# EAGLE design Doorbell (EAGLE 8.1.0)
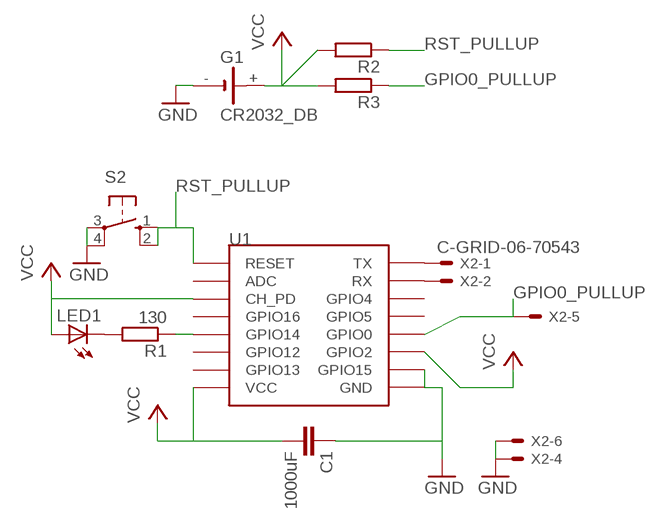
[diagram p0: schematic, sheet 1]

## Parts
C1  1000uF  C5/3.5  [C5B3.5]
G1  CR2032_DB  [CR2032_DOORBELL]
LED1  LED3MM  [LED3MM]
R1  130  R-EU_0204/5  [0204/5]
R2  R-EU_0204/5  [0204/5]
R3  R-EU_0204/5  [0204/5]
S2  10-XX  [B3F-10XX]
U1  ESP12  [ESP12]
X2  C-GRID-06-70543  [70543-06]

## Nets
GND: C1.1 G1.- S2.3(P) S2.4(P1) U1.GND U1.GPIO15 X2.4 X2.6
GPIO0_PULLUP: R3.1 U1.GPIO0 X2.5
N$1: U1.TX X2.1
N$2: U1.RX X2.2
N$5: R1.1 U1.GPIO14
N$6: LED1.K(C) R1.2
RST_PULLUP: R2.1 S2.1(S) S2.2(S1) U1.RESET
VCC: C1.2 G1.+ LED1.A R2.2 R3.2 U1.CH_PD U1.GPIO2 U1.VCC
Unconnected: U1.ADC U1.GPIO4 U1.GPIO5 U1.GPIO12 U1.GPIO13 U1.GPIO16 X2.3

## Library data of the parts
C1 = capacitor-wima:C: CAPACITOR naming: grid - package width
G1 = battery:CR2032_DB
LED1 = led:LED: LED OSRAM: - CHIPLED LG R971, LG N971, LY N971, LG Q971, LY Q971, LO R971, LY R971 LH N974, LH R974 LS Q976, LO Q976, LY Q976 LO Q996 - Hyper CHIPLED LW Q18S LB Q993, LB Q99A, LB R99A - SideLED LS A670, LO A670, LY A670, LG A670, LP A670 LB A673, LV A673, LT A673, LW A673 LH A674 LY A675 LS A676, LA A676, LO A676, LY A676, LW A676 LS A679, LY A679, LG A679 - Hyper Micro SIDELED® LS Y876, LA Y876, LO Y876, LY Y876 LT Y87S - SmartLED LW L88C, LW L88S LB L89C, LB L89S, LG L890 LS L89K, LO L89K, LY L89K LS L896, LA L896, LO L896, LY L896 - TOPLED LS T670, LO T670, LY T670, LG T670, LP T670 LSG T670, LSP T670, LSY T670, LOP T670, LYG T670 LG T671, LOG T671, LSG T671 LB T673, LV T673, LT T673, LW T673 LH T674 LS T676, LA T676, LO T676, LY T676, LB T676, LH T676, LSB T676, LW T676 LB T67C, LV T67C, LT T67C, LS T67K, LO T67K, LY T67K, LW E67C LS E67B, LA E67B, LO E67B, LY E67B, LB E67C, LV E67C, LT E67C LW T67C LS T679, LY T679, LG T679 LS T770, LO T770, LY T770, LG T770, LP T770 LB T773, LV T773, LT T773, LW T773 LH T774 LS E675, LA E675, LY E675, LS T675 LS T776, LA T776, LO T776, LY T776, LB T776 LHGB T686 LT T68C, LB T68C - Hyper Mini TOPLED® LB M676 - Mini TOPLED Santana® LG M470 LS M47K, LO M47K, LY M47K Source: http://www.osram.convergy.de LUXEON: - LUMILED® LXK2-PW12-R00, LXK2-PW12-S00, LXK2-PW14-U00, LXK2-PW14-V00 LXK2-PM12-R00, LXK2-PM12-S00, LXK2-PM14-U00 LXK2-PE12-Q00, LXK2-PE12-R00, LXK2-PE12-S00, LXK2-PE14-T00, LXK2-PE14-U00 LXK2-PB12-K00, LXK2-PB12-L00, LXK2-PB12-M00, LXK2-PB14-N00, LXK2-PB14-P00, LXK2-PB14-Q00 LXK2-PR12-L00, LXK2-PR12-M00, LXK2-PR14-Q00, LXK2-PR14-R00 LXK2-PD12-Q00, LXK2-PD12-R00, LXK2-PD12-S00 LXK2-PH12-R00, LXK2-PH12-S00 LXK2-PL12-P00, LXK2-PL12-Q00, LXK2-PL12-R00 Source: www.luxeon.com KINGBRIGHT: KA-3528ASYC Source: www.kingbright.com
R1-R3 = resistor:R-EU_: RESISTOR, European symbol
S2 = switch-omron:10-XX: OMRON SWITCH; MPN: B3F-1000; OC_FARNELL: 176432; OC_NEWARK: 36M3542
U1 = esp8266modules:ESP12: ESP8266 Wifi module 12
X2 = con-molex:C-GRID-06: CONNECTOR wire to board 2.54 mm (0.100") pitch header; OC_FARNELL: unknown; OC_NEWARK: unknown

## Board
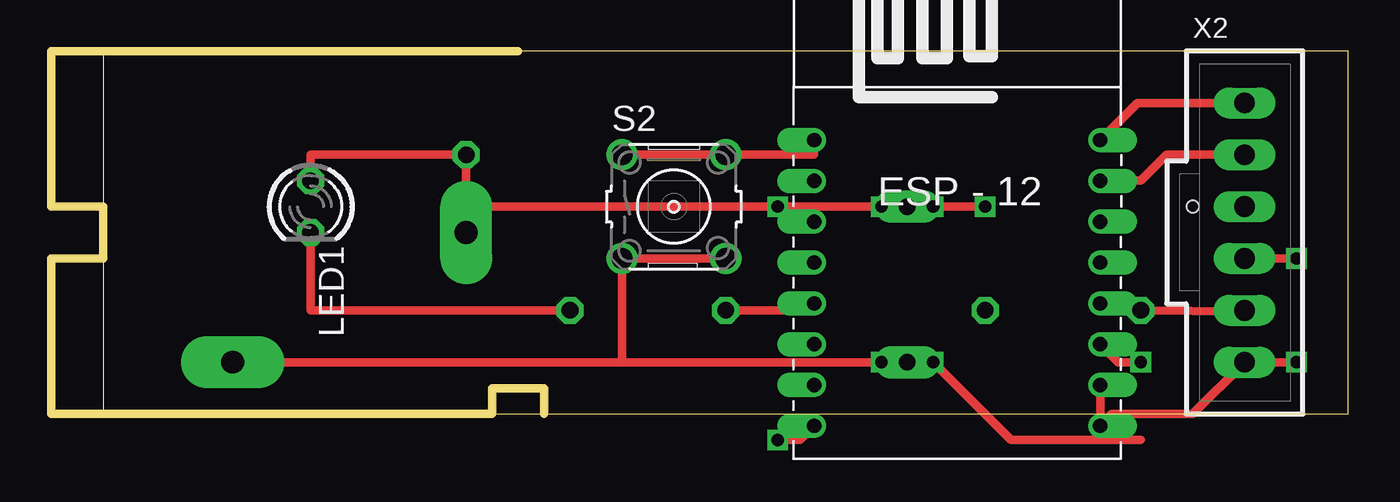
[diagram p1: board, top side]
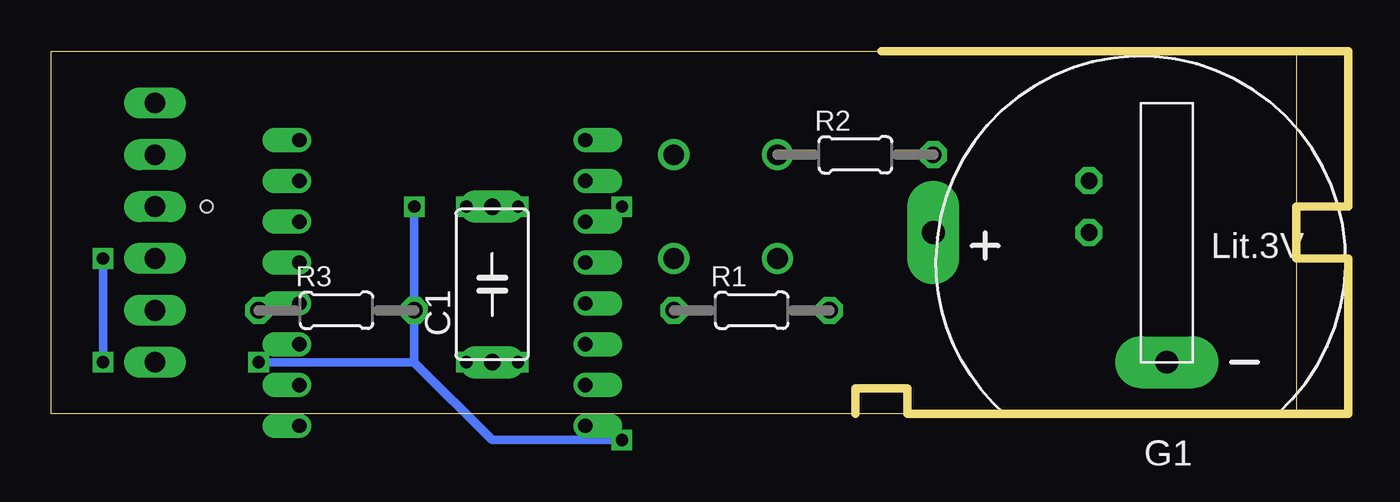
[diagram p2: board, bottom side, seen from below]

Size 63.5 x 17.78 mm. Coordinates in mm from the lower left corner, seen from the top.
Outline: 21.59,0 24.13,0
Outline: 24.13,0 63.5,0 63.5,17.78 22.86,17.78 2.54,17.78
Outline: 2.54,17.78 2.54,10.16
Outline: 2.54,7.62 2.54,0
Outline: 2.54,10.16 0,10.16 0,17.78 2.54,17.78
Outline: 2.54,7.62 0,7.62 0,0 2.54,0
Outline: 21.59,0 21.59,1.27 24.13,1.27 24.13,0
Outline: 21.59,0 2.54,0
Outline: 2.54,10.16 2.54,7.62
Copper layers (1*16): Top 0.035mm / dielectric 1.5mm / Bottom 0.035mm
Design rules "default": minimum track width 10mil, minimum drill 24mil, track to track 8mil, track to pad 8mil, pad to pad 8mil, via to via 8mil, smd to smd 8mil, copper to edge 40mil, drill to drill 8mil, minimum pad ring 10mil, minimum via ring 8mil, stop-mask expansion 4mil, vias tented up to drill 0mil, thermal gap 10mil
Holes 0.6 mm at 55.88,10.16

### Footprints (pad centres in the part's own frame; a part is rotated, then mirrored left to right if it is on the bottom)
C5B3.5 = drill 0.813 pad 1.6 long: 1 -3.81,0; 2 3.81,0
CR2032_DOORBELL = drill 1.118 pad 2.54 long: + 10.16,-1.27; - -1.27,5.08
LED3MM = drill 0.813 octagon: A -1.27,0; K 1.27,0
0204/5 = drill 0.813 octagon: 1 -3.81,0; 2 3.81,0
B3F-10XX = drill 1.016: 1 -2.54,2.54; 2 2.54,2.54; 3 -2.54,-2.54; 4 2.54,-2.54
ESP12 = drill 0.7 offset: ADC -7.1,3.8; CH_PD -7.1,1.8; GND 6.9,-8.2; GPIO0 6.9,-2.2; GPIO2 6.9,-4.2; GPIO4 6.9,1.8; GPIO5 6.9,-0.2; GPIO12 -7.1,-4.2; GPIO13 -7.1,-6.2; GPIO14 -7.1,-2.2; GPIO15 6.9,-6.2; GPIO16 -7.1,-0.2; RESET -7.1,5.8; RX 6.9,3.8; TX 6.9,5.8; VCC -7.1,-8.2
70543-06 = drill 1.016 long: 1 -6.35,0; 2 -3.81,0; 3 -1.27,0; 4 1.27,0; 5 3.81,0; 6 6.35,0

### Placement (x,y rotation side)
C1  41.91,6.35 90 bottom
G1  10.16,7.62 180 bottom
LED1  12.7,10.16 270 top
R1  29.21,5.08 0 bottom
R2  24.13,12.7 0 bottom
R3  49.53,5.08 0 bottom
S2  30.48,10.16 0 top
U1  44.45,7.62 0 top
X2  58.42,8.89 270 top

### Tracks (layer width: path | path; a pad name or v marks a point on that pad's centre or on a via)
GND  (via drill 0.6)
  Top 0.406: 51.35,1.22 U1.GPIO15 U1.GND | v60.96,2.54 X2.6 55.88,0 51.93,0 U1.GND | X2.4 v60.96,7.62 | S2.4 S2.3 27.94,2.54 | v40.64,2.54 27.94,2.54 | 27.94,2.54 G1.- | v43.18,2.54 C1.1 v43.18,2.54 | v43.18,2.54 46.99,-1.27 53.34,-1.27 52.04,-1.27 U1.GND
  Bottom 0.406: v60.96,7.62 v60.96,2.54 | v40.64,2.54 C1.1
GPIO0_PULLUP
  Top 0.406: X2.5 58.36,5.02 R3.1 53.14,5.42 U1.GPIO0
N$1
  Top 0.406: U1.TX 53.17,15.24 X2.1
N$2
  Top 0.406: X2.2 54.61,12.7 53.34,11.43 U1.RX
N$5
  Top 0.406: R1.1 37.35,5.08 U1.GPIO14
N$6
  Top 0.406: R1.2 12.7,5.08 LED1.K
RST_PULLUP
  Top 0.406: U1.RESET 37.35,12.7 S2.2 R2.1
VCC  (via drill 0.6)
  Top 0.406: v53.34,2.54 52.23,2.54 U1.GPIO2 | v35.56,10.16 36.61,10.16 U1.CH_PD | 20.32,10.16 G1.+ | 20.32,10.16 R2.2 12.7,12.7 LED1.A | v35.56,10.16 20.32,10.16 | v43.18,10.16 v45.72,10.16 | C1.2 v35.56,10.16 | v35.56,-1.27 36.66,-1.27 U1.VCC
  Bottom 0.406: 45.72,2.54 R3.2 v45.72,10.16 | 45.72,2.54 v53.34,2.54 | v40.64,10.16 C1.2 v43.18,10.16 | 45.72,2.54 41.91,-1.27 v35.56,-1.27